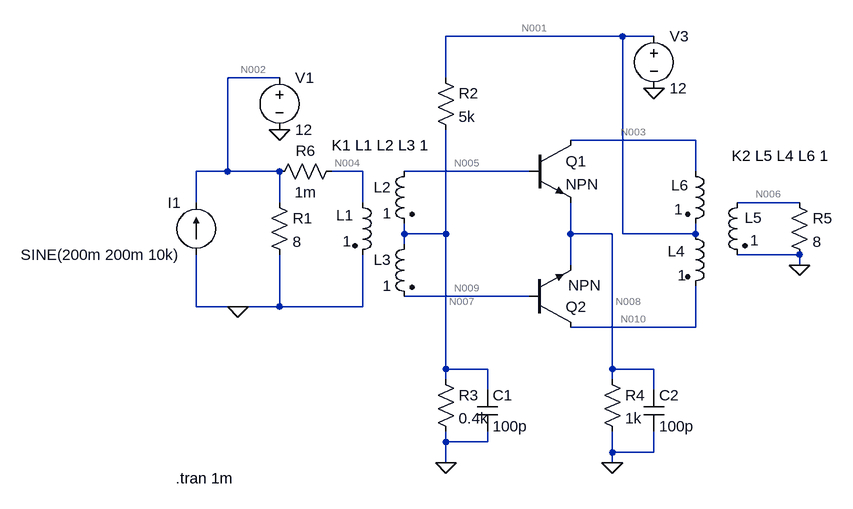
[diagram p0: schematic Push Pull attempt.asc]
Push Pull attempt.asc, the LTspice schematic file:
Version 4
SHEET 1 880 680
WIRE 416 -144 144 -144
WIRE 464 -144 416 -144
WIRE -112 -80 -192 -80
WIRE 144 -80 144 -144
WIRE 528 16 336 16
WIRE -192 64 -192 -80
WIRE -192 64 -240 64
WIRE -112 64 -192 64
WIRE 16 64 -32 64
WIRE 272 64 80 64
WIRE 528 64 528 16
WIRE -240 112 -240 64
WIRE -112 112 -112 64
WIRE 16 112 16 64
WIRE 688 112 592 112
WIRE 80 160 80 144
WIRE 144 160 144 0
WIRE 144 160 80 160
WIRE 336 160 336 112
WIRE 400 160 336 160
WIRE 416 160 416 -144
WIRE 528 160 528 144
WIRE 528 160 416 160
WIRE 80 176 80 160
WIRE 688 192 592 192
WIRE 336 208 336 160
WIRE 688 208 688 192
WIRE 272 256 80 256
WIRE -240 272 -240 192
WIRE -176 272 -240 272
WIRE -112 272 -112 192
WIRE -112 272 -176 272
WIRE 16 272 16 192
WIRE 16 272 -112 272
WIRE 528 304 528 240
WIRE 528 304 336 304
WIRE 144 368 144 160
WIRE 208 368 144 368
WIRE 400 368 400 160
WIRE 464 368 400 368
WIRE 144 384 144 368
WIRE 400 384 400 368
WIRE 208 400 208 368
WIRE 464 400 464 368
WIRE 144 480 144 464
WIRE 208 480 208 464
WIRE 208 480 144 480
WIRE 400 496 400 464
WIRE 464 496 464 464
WIRE 464 496 400 496
WIRE 144 512 144 480
WIRE 400 512 400 496
FLAG 144 512 0
FLAG 400 512 0
FLAG 688 208 0
FLAG 464 -64 0
FLAG -176 272 0
FLAG -112 0 0
SYMBOL npn 272 16 R0
SYMATTR InstName Q1
SYMBOL npn 272 304 M180
WINDOW 3 60 65 Left 2
SYMATTR InstName Q2
SYMBOL res -128 96 R0
SYMATTR InstName R1
SYMATTR Value 8
SYMBOL ind2 0 96 R0
WINDOW 0 -25 35 Left 2
WINDOW 3 -15 75 Left 2
SYMATTR InstName L1
SYMATTR Value 1
SYMATTR Type ind
SYMBOL ind2 96 48 M0
SYMATTR InstName L2
SYMATTR Value 1
SYMATTR Type ind
SYMBOL ind2 96 160 M0
SYMATTR InstName L3
SYMATTR Value 1
SYMATTR Type ind
SYMBOL ind2 512 144 R0
WINDOW 0 -27 43 Left 2
WINDOW 3 -11 80 Left 2
SYMATTR InstName L4
SYMATTR Value 1
SYMATTR Type ind
SYMBOL ind2 608 96 M0
WINDOW 0 -23 39 Left 2
WINDOW 3 -18 74 Left 2
SYMATTR InstName L5
SYMATTR Value 1
SYMATTR Type ind
SYMBOL res 128 -96 R0
SYMATTR InstName R2
SYMATTR Value 5k
SYMBOL res 128 368 R0
SYMATTR InstName R3
SYMATTR Value 0.4k
SYMBOL cap 192 400 R0
SYMATTR InstName C1
SYMATTR Value 100p
SYMBOL res 384 368 R0
SYMATTR InstName R4
SYMATTR Value 1k
SYMBOL cap 448 400 R0
SYMATTR InstName C2
SYMATTR Value 100p
SYMBOL res 672 96 R0
SYMATTR InstName R5
SYMATTR Value 8
SYMBOL voltage 464 -160 R0
WINDOW 123 0 0 Left 0
WINDOW 39 0 0 Left 0
SYMATTR InstName V3
SYMATTR Value 12
SYMBOL ind2 512 48 R0
WINDOW 0 -21 37 Left 2
WINDOW 3 -17 74 Left 2
SYMATTR InstName L6
SYMATTR Value 1
SYMATTR Type ind
SYMBOL current -240 192 R180
WINDOW 0 24 80 Left 2
WINDOW 3 24 0 Left 2
WINDOW 123 0 0 Left 0
WINDOW 39 0 0 Left 0
SYMATTR InstName I1
SYMATTR Value SINE(200m 200m 10k)
SYMBOL voltage -112 -96 R0
WINDOW 123 0 0 Left 0
WINDOW 39 0 0 Left 0
SYMATTR InstName V1
SYMATTR Value 12
SYMBOL res -16 48 R90
WINDOW 0 0 56 VBottom 2
WINDOW 3 32 56 VTop 2
SYMATTR InstName R6
SYMATTR Value 1m
TEXT -272 536 Left 2 !.tran 1m
TEXT -32 24 Left 2 !K1 L1 L2 L3 1
TEXT 584 40 Left 2 !K2 L5 L4 L6 1

The netlist it stands for:
* Push Pull attempt.asc
Q1 N003 N005 N008 0 NPN
Q2 N010 N009 N008 0 NPN
R1 N002 0 8
L1 N004 0 1
L2 N005 N007 1
L3 N007 N009 1
L4 N001 N010 1
L5 N006 0 1
R2 N001 N007 5k
R3 N007 0 0.4k
C1 N007 0 100p
R4 N008 0 1k
C2 N008 0 100p
R5 N006 0 8
V3 N001 0 12
L6 N003 N001 1
I1 0 N002 SINE(200m 200m 10k)
V1 N002 0 12
R6 N004 N002 1m
.model NPN NPN
.model PNP PNP
.lib standard.bjt
.tran 1m
K1 L1 L2 L3 1
K2 L5 L4 L6 1
.backanno
.end

* Results of the author's LTspice run, read from the files saved beside the schematic
* Operating Point, zero values left out:
*   V(n003) = 12 V
*   V(n005) = 888.2 mV
*   V(n008) = 177 mV
*   V(n010) = 12 V
*   V(n009) = 888.2 mV
*   V(n002) = 12 V
*   V(n007) = 888.2 mV
*   V(n001) = 12 V
*   Ic(Q2) = 87.62 µA
*   Ib(Q2) = 876.1 nA
*   Ie(Q2) = -88.49 µA
*   Ic(Q1) = 87.62 µA
*   Ib(Q1) = 876.1 nA
*   Ie(Q1) = -88.49 µA
*   I(L6) = -87.62 µA
*   I(L4) = 87.62 µA
*   I(L3) = 876.1 nA
*   I(L2) = -876.1 nA
*   I(L1) = 12 kA
*   I(I1) = 200 mA
*   I(R6) = -12 kA
*   I(R4) = 177 µA
*   I(R3) = 2.221 mA
*   I(R2) = 2.222 mA
*   I(R1) = 1.5 A
*   I(V1) = -12 kA
*   I(V3) = -2.398 mA
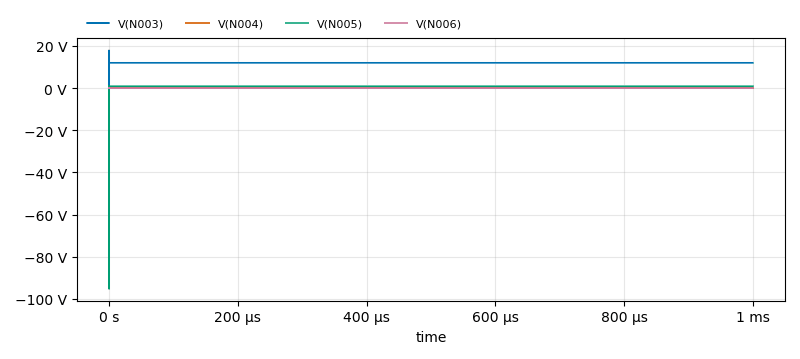
[diagram p1: Transient Analysis of Push Pull attempt.asc, plotted from the saved traces]
* Transient Analysis, 1 run:
*   V(N003): min 225.9 mV, max 17.91 V, average 12 V, rms 12 V, last 12 V
*   V(N004): min -1.398 µV, max 3.102 µV, average 0 V, rms 2.337 nV, last -8.258 pV
*   V(N005): min -95.17 V, max 1.025 V, average 888.2 mV, rms 890.8 mV, last 888.4 mV
*   V(N006): min -94.87 mV, max 13.41 mV, average -170.3 nV, rms 96.46 µV, last -6.616 µV